# Altium schematic sheet X-Track_Sheet.SchDoc
size A3
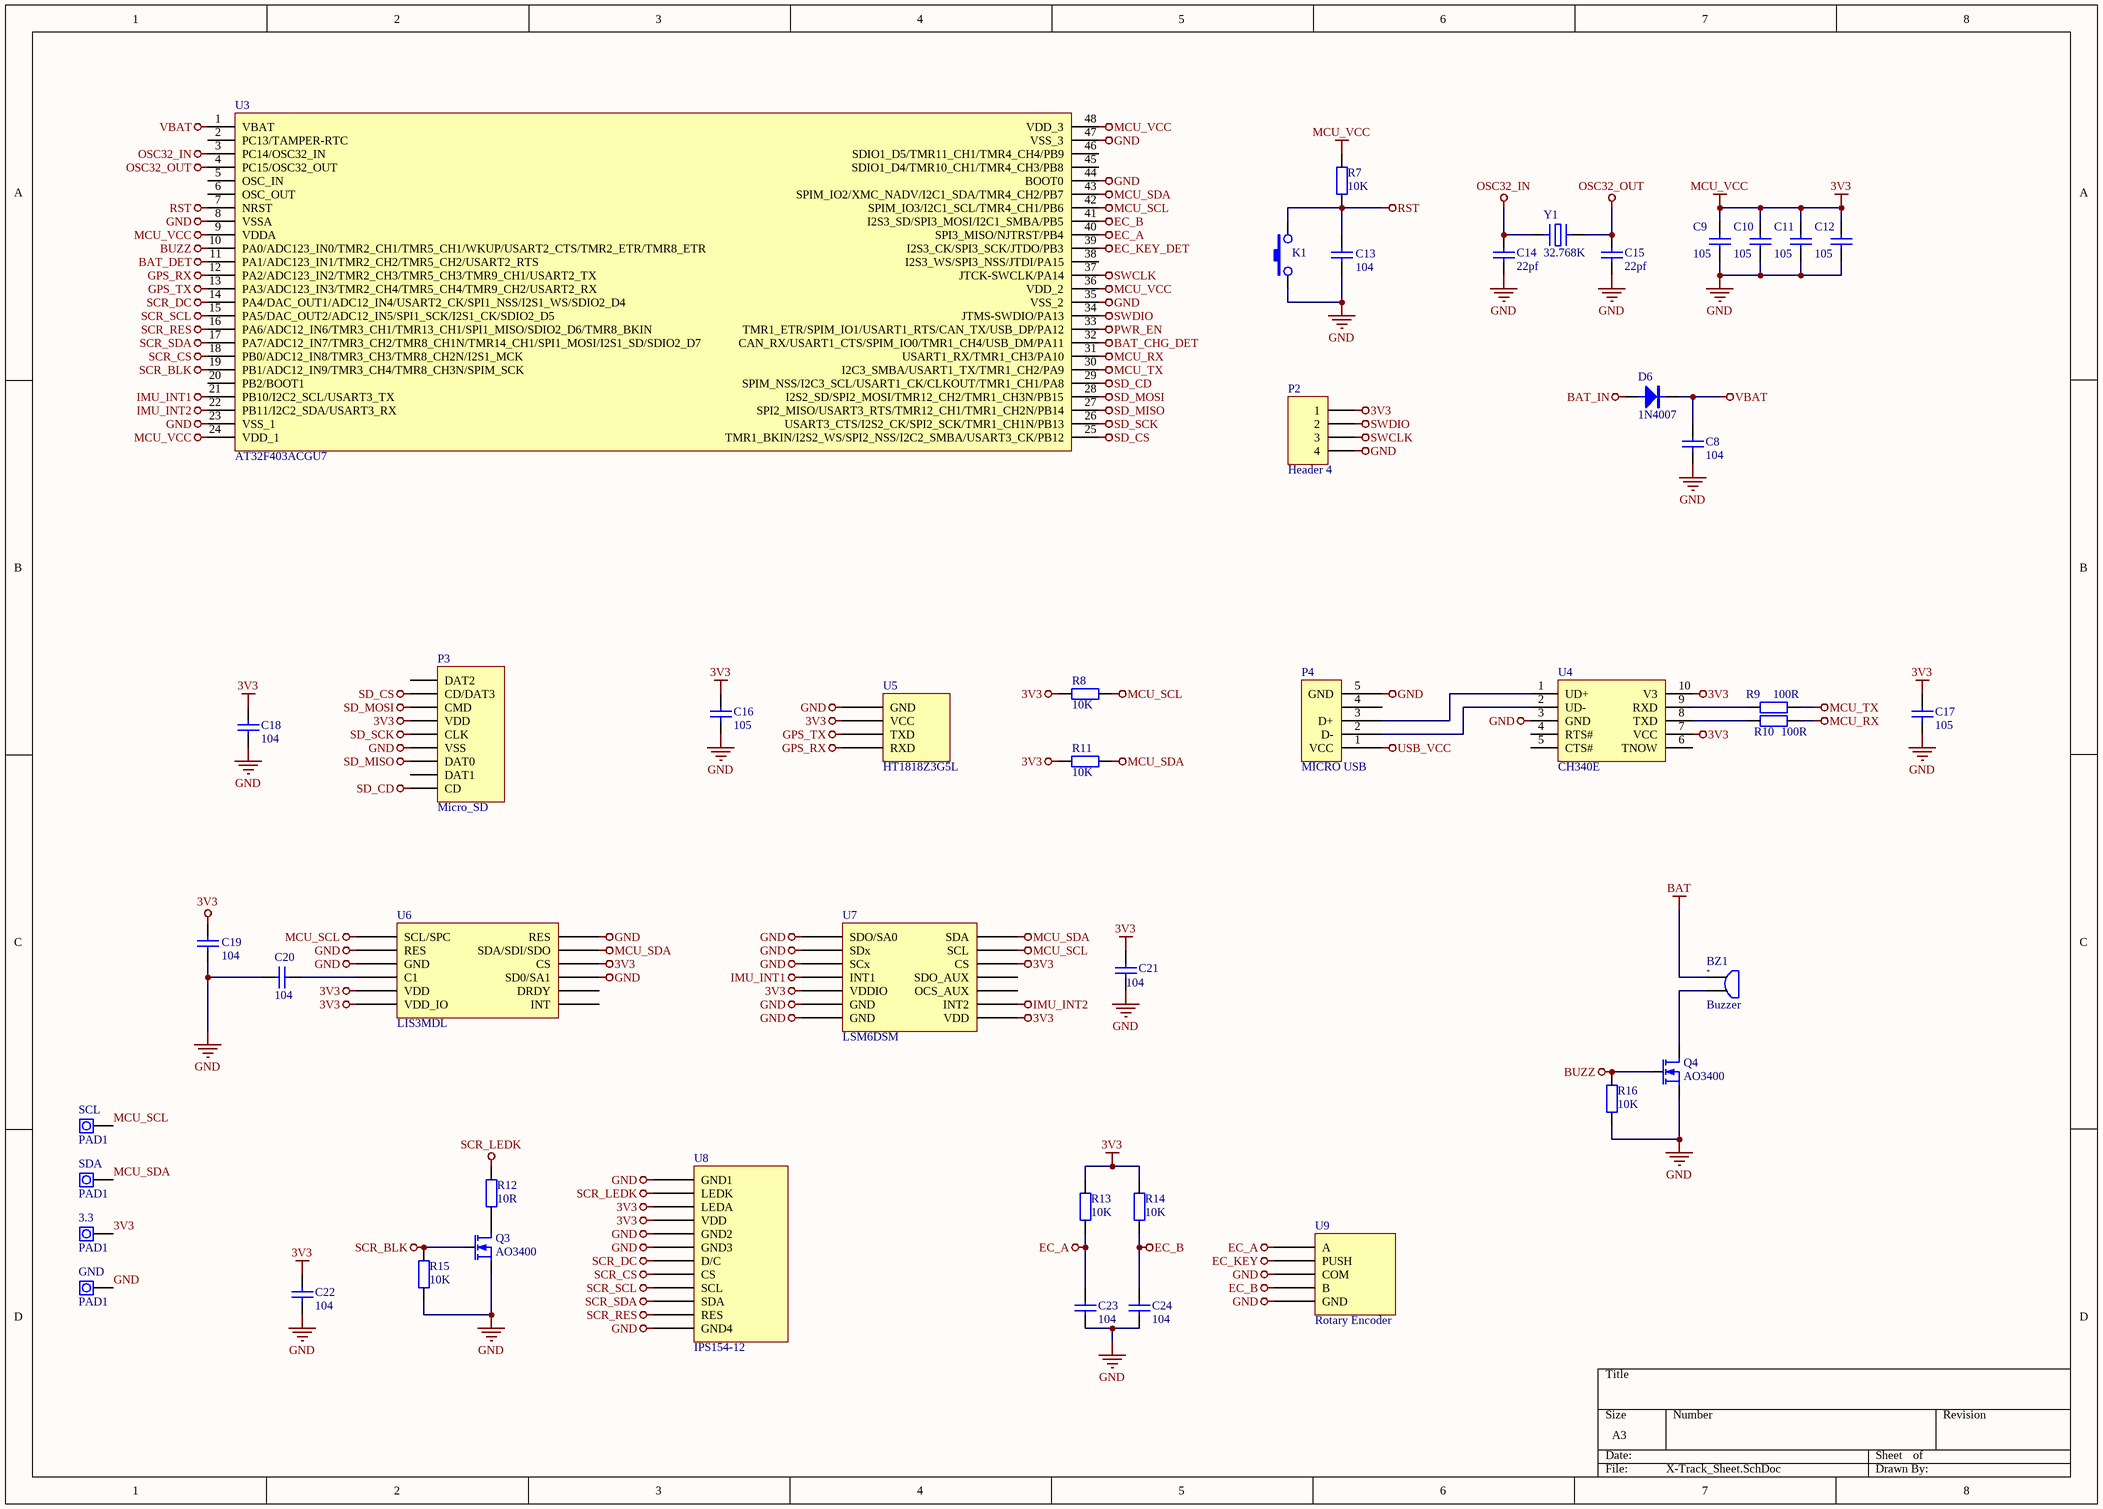
[diagram p0: X-Track_Sheet.SchDoc]

## Parts
3.3  PAD1  [PAD1-SMD-C]
BZ1  Buzzer  [蜂鸣器_SMD5020]
C8  104  [电容_C0603]
C9  105  [电容_C0603]
C10  105  [电容_C0603]
C11  105  [电容_C0603]
C12  105  [电容_C0603]
C13  104  [电容_C0603]
C14  22pf  [电容_C0603]
C15  22pf  [电容_C0603]
C16  105  [电容_C0603]
C17  105  [电容_C0603]
C18  104  [电容_C0603]
C19  104  [电容_C0603]
C20  104  [电容_C0603]
C21  104  [电容_C0603]
C22  104  [电容_C0603]
C23  104  [电容_C0603]
C24  104  [电容_C0603]
D6  1N4007  [二极管_SOD-323]
GND  PAD1  [PAD1-SMD-C]
K1  SKRP  [开关按键_SKRP]  (value not drawn)
P2  Header 4  [HDR1X4H]
P3  Micro_SD  [接插件_Micro_SD]
P4  MICRO USB  [接插件_MICRO 牛角插座 USB 直边]
Q3  AO3400  [MOS_SOT-23]
Q4  AO3400  [MOS_SOT-23]
R7  10K  [电阻_R0603]
R8  10K  [电阻_R0603]
R9  100R  [电阻_R0603]
R10  100R  [电阻_R0603]
R11  10K  [电阻_R0603]
R12  10R  [电阻_R0603]
R13  10K  [电阻_R0603]
R14  10K  [电阻_R0603]
R15  10K  [电阻_R0603]
R16  10K  [电阻_R0603]
SCL  PAD1  [PAD1-SMD-C]
SDA  PAD1  [PAD1-SMD-C]
U3  AT32F403ACGU7  [LQFP48 7X7_L]
U4  CH340E  [串口_MSOP10]
U5  HT1818Z3G5L  [GPS-HTZN]
U6  LIS3MDL  [LGA-12_L2.0-W2.0-P0.50-BL]
U7  LSM6DSM  [LGA-14_L3.0-W2.5-P0.50-BL]
U8  IPS154-12  [ZJY154T-PG04 FPC 0.7mm]
U9  Rotary Encoder  [SIQ-02FVS3]
Y1  32.768K  [晶振_3215]

## Nets
3V3: 3.3.1 C9.2 C10.2 C11.2 C12.2 C16.1 C17.1 C18.1 C19.2 C21.1 C22.1 P2.1 P3.4(VDD) R7.2 R8.2 R11.2 R13.2 R14.2 U3.9(VDDA) U3.24(VDD_1) U3.36(VDD_2) U3.48(VDD_3) U4.7(VCC) U4.10(V3) U5.2(VCC) U6.5(VDD) U6.6(VDD_IO) U6.10(CS) U7.5(VDDIO) U7.8(VDD) U7.12(CS) U8.3(LEDA) U8.4(VDD)  [also labelled MCU_VCC]
BAT: BZ1.1
BAT_CHG_DET: U3.32(CAN_RX/USART1_CTS/SPIM_IO0/TMR1_CH4/USB_DM/PA11)
BAT_DET: U3.11(PA1/ADC123_IN1/TMR2_CH2/TMR5_CH2/USART2_RTS)
BAT_IN: D6.A
BUZZ: Q4.1(G) R16.2 U3.10(PA0/ADC123_IN0/TMR2_CH1/TMR5_CH1/WKUP/USART2_CTS/TMR2_ETR/TMR8_ETR)
EC_A: C23.1 R13.1 U3.40(SPI3_MISO/NJTRST/PB4) U9.1(A)
EC_B: C24.1 R14.1 U3.41(I2S3_SD/SPI3_MOSI/I2C1_SMBA/PB5) U9.4(B)
EC_KEY: U9.2(PUSH)
EC_KEY_DET: U3.39(I2S3_CK/SPI3_SCK/JTDO/PB3)
GND: C8.1 C9.1 C10.1 C11.1 C12.1 C13.1 C14.2 C15.2 C16.2 C17.2 C18.2 C19.1 C20.2 C21.2 C22.2 C23.2 C24.2 GND.1 K1.1 P2.4 P3.0(GND) P3.6(VSS) P4.0 P4.5(GND) Q3.3(S) Q4.3(S) R15.1 R16.1 U3.0(VSS) U3.8(VSSA) U3.23(VSS_1) U3.35(VSS_2) U3.44(BOOT0) U3.47(VSS_3) U4.3(GND) U5.1(GND) U6.2(RES) U6.3(GND) U6.9(SD0/SA1) U6.12(RES) U7.1(SDO/SA0) U7.2(SDx) U7.3(SCx) U7.6(GND) U7.7(GND) U8.1(GND1) U8.5(GND2) U8.6(GND3) U8.12(GND4) U9.3(COM) U9.5(GND)
GPS_RX: U3.12(PA2/ADC123_IN2/TMR2_CH3/TMR5_CH3/TMR9_CH1/USART2_TX) U5.4(RXD)
GPS_TX: U3.13(PA3/ADC123_IN3/TMR2_CH4/TMR5_CH4/TMR9_CH2/USART2_RX) U5.3(TXD)
IMU_INT1: U3.21(PB10/I2C2_SCL/USART3_TX) U7.4(INT1)
IMU_INT2: U3.22(PB11/I2C2_SDA/USART3_RX) U7.9(INT2)
MCU_RX: R10.1 U3.31(USART1_RX/TMR1_CH3/PA10)
MCU_SCL: R8.1 SCL.1 U3.42(SPIM_IO3/I2C1_SCL/TMR4_CH1/PB6) U6.1(SCL/SPC) U7.13(SCL)
MCU_SDA: R11.1 SDA.1 U3.43(SPIM_IO2/XMC_NADV/I2C1_SDA/TMR4_CH2/PB7) U6.11(SDA/SDI/SDO) U7.14(SDA)
MCU_TX: R9.1 U3.30(I2C3_SMBA/USART1_TX/TMR1_CH2/PA9)
OSC32_IN: C14.1 U3.3(PC14/OSC32_IN) Y1.1
OSC32_OUT: C15.1 U3.4(PC15/OSC32_OUT) Y1.2
PWR_EN: U3.33(TMR1_ETR/SPIM_IO1/USART1_RTS/CAN_TX/USB_DP/PA12)
RST: C13.2 K1.2 R7.1 U3.7(NRST)
SCR_BLK: Q3.1(G) R15.2 U3.19(PB1/ADC12_IN9/TMR3_CH4/TMR8_CH3N/SPIM_SCK)
SCR_CS: U3.18(PB0/ADC12_IN8/TMR3_CH3/TMR8_CH2N/I2S1_MCK) U8.8(CS)
SCR_DC: U3.14(PA4/DAC_OUT1/ADC12_IN4/USART2_CK/SPI1_NSS/I2S1_WS/SDIO2_D4) U8.7(D/C)
SCR_LEDK: R12.2 U8.2(LEDK)
SCR_RES: U3.16(PA6/ADC12_IN6/TMR3_CH1/TMR13_CH1/SPI1_MISO/SDIO2_D6/TMR8_BKIN) U8.11(RES)
SCR_SCL: U3.15(PA5/DAC_OUT2/ADC12_IN5/SPI1_SCK/I2S1_CK/SDIO2_D5) U8.9(SCL)
SCR_SDA: U3.17(PA7/ADC12_IN7/TMR3_CH2/TMR8_CH1N/TMR14_CH1/SPI1_MOSI/I2S1_SD/SDIO2_D7) U8.10(SDA)
SD_CD: P3.9(CD) U3.29(SPIM_NSS/I2C3_SCL/USART1_CK/CLKOUT/TMR1_CH1/PA8)
SD_CS: P3.2(CD/DAT3) U3.25(TMR1_BKIN/I2S2_WS/SPI2_NSS/I2C2_SMBA/USART3_CK/PB12)
SD_MISO: P3.7(DAT0) U3.27(SPI2_MISO/USART3_RTS/TMR12_CH1/TMR1_CH2N/PB14)
SD_MOSI: P3.3(CMD) U3.28(I2S2_SD/SPI2_MOSI/TMR12_CH2/TMR1_CH3N/PB15)
SD_SCK: P3.5(CLK) U3.26(USART3_CTS/I2S2_CK/SPI2_SCK/TMR1_CH1N/PB13)
SWCLK: P2.3 U3.37(JTCK-SWCLK/PA14)
SWDIO: P2.2 U3.34(JTMS-SWDIO/PA13)
USB_VCC: P4.1(VCC)
VBAT: C8.2 D6.K U3.1(VBAT)
NetBZ1_2: BZ1.2 Q4.2(D)
NetC20_1: C20.1 U6.4(C1)
NetP4_2: P4.2(D-) U4.2(UD-)
NetP4_3: P4.3(D+) U4.1(UD+)
NetQ3_2: Q3.2(D) R12.1
NetR9_2: R9.2 U4.9(RXD)
NetR10_2: R10.2 U4.8(TXD)

Not connected (* = marked no-connect by the designer): P3 1(DAT2) 8(DAT1); P4 4; U3 2(PC13/TAMPER-RTC) 5(OSC_IN) 6(OSC_OUT) 20(PB2/BOOT1) 38(I2S3_WS/SPI3_NSS/JTDI/PA15) 45(SDIO1_D4/TMR10_CH1/TMR4_CH3/PB8) 46(SDIO1_D5/TMR11_CH1/TMR4_CH4/PB9); U4 4(RTS#) 5(CTS#) 6(TNOW); U6 7(INT) 8(DRDY); U7 10(OCS_AUX) 11(SDO_AUX)

## Notes on the sheet
- (in symbol BZ) +

## Library data of the parts
3.3 GND SCL SDA = PAD1: 引线焊盘; 版权归属: 源创客; BOM名称: 引线焊盘; 学习资源: www.ooocke.com
BZ1 = BZ: _Comma: ,; _Footprint: 12*9.5mm,SOT塑封管; _Model: 12V; _Specification: Buzzer,12V,12*9.5mm,SOT塑封管; _Name: Buzzer
C8-C24 = cap: U: 50V; 参数: Cap,0805,X7R,104K,50V,125C,±10%
  C8 C13 C18-C24: C: 104
  C9-C12 C16 C17: C: 105
  C14 C15: C: 22pf
D6 = Diode: _Specification: Diode,1N4007,SOD-323,1A,40V; _Comma: ,; _Footprint: SOD-323; _Voltage: 40V; _Current: 1A; _Name: Diode; _Model: 1N4007
K1 = SW-PB: _Comma: ,; _Name: KEY; _Specification: KEY,SKRP,*; _Footprint: *; _Model: SKRP
P2 = Header 4: Header, 4-Pin; LatestRevisionDate: 17-Jul-2002; LatestRevisionNote: Re-released for DXP Platform.; Publisher: Altium Limited
P3 = Micro_SD: _Comma: ,; _Name: Port; _Specification: Port,Micro_SD,TF,9PIN; _Value: TF,9PIN; _Model: Micro_SD
P4 = MICRO USB 5PIN: _Comma: ,; _Name: Port; _Specification: Port,MICRO USB,5PIN; _Value: 5PIN; _Model: MICRO USB
Q3 Q4 = MOSFET-N: _Comma: ,; _Current: 150A; _Footprint: DFN5*6; _Name: N-MOSFET; _Specification: N-MOSFET,AO3400,DFN5*6,150A,30V; _Voltage: 30V; _Model: AO3400
R7 R9 R10 R15 R16 = Res: P: 1/8W; 参数: Res,0805,0R,±1%,1/8W,100ppm,155C
  R7 R15 R16: R: 10K
  R9 R10: R: 100R
R8 R11 R13 R14 = Res: _Accuracy: 1%; _Power: 1/8W; _Footprint: 0805; _Drift: 100ppm; _Comma: ,; _Specification: Res,0805,10K,1%,1/8W,100ppm; _Name: Res; _Value: 10K
R12 = Res: _Accuracy: 1%; _Power: 1/8W; _Footprint: 0805; _Drift: 100ppm; _Comma: ,; _Specification: Res,0805,10R,1%,1/8W,100ppm; _Name: Res; _Value: 10R
U3 = AT32F403CGU6: _Footprint: QFN48; _Comma: ,; _Name: MCU; _Specification: MCU,AT32F403ACGU7,QFN48; _Model: AT32F403ACGU7
U4 = CH340E: _Comma: ,; _Footprint: MSOP10; _Name: USB-UART; _Specification: USB-UART,CH340E,MSOP10; _Model: CH340E
U6 = LIS3DMDL
Y1 = XTAL_A: _Name: CRYSTALS; _Comma: ,; _Specification: CRYSTALS,32.768K,*,10ppm,12pF; _Accuracy: 10ppm; _CL: 12pF; _Footprint: *; _Frequency: 32.768K